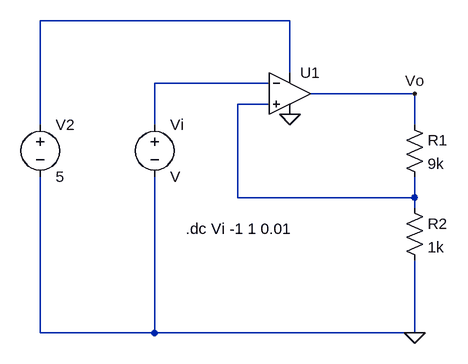
[diagram p0: schematic Experiment 12.asc]
Experiment 12.asc, the LTspice schematic file:
Version 4
SHEET 1 880 680
WIRE 256 32 -128 32
WIRE 256 112 256 32
WIRE 224 128 48 128
WIRE 448 144 288 144
WIRE 224 160 176 160
WIRE -128 192 -128 32
WIRE 48 192 48 128
WIRE 448 192 448 144
WIRE 176 304 176 160
WIRE 448 304 448 272
WIRE 448 304 176 304
WIRE 448 320 448 304
WIRE -128 512 -128 272
WIRE 48 512 48 272
WIRE 48 512 -128 512
WIRE 448 512 448 400
WIRE 448 512 48 512
FLAG 256 176 0
FLAG 448 512 0
FLAG 448 144 Vo
SYMBOL Opamps\\UniversalOpamp2 256 144 R0
SYMATTR InstName U1
SYMBOL voltage 48 176 R0
SYMATTR InstName Vi
SYMBOL res 432 176 R0
SYMATTR InstName R1
SYMATTR Value 9k
SYMBOL res 432 304 R0
SYMATTR InstName R2
SYMATTR Value 1k
SYMBOL voltage -128 176 R0
WINDOW 123 0 0 Left 0
WINDOW 39 0 0 Left 0
SYMATTR InstName V2
SYMATTR Value 5
TEXT 96 352 Left 2 !.dc Vi -1 1 0.01

The netlist it stands for:
* Experiment 12.asc
XU1 N003 N002 N001 0 Vo level.2 Avol=1Meg GBW=10Meg Slew=10Meg ilimit=25m rail=0 Vos=0 phimargin=45 en=0 enk=0 in=0 ink=0 Rin=500Meg  ; pins IN+ IN- V+ V- OUT
Vi N002 0 V
R1 Vo N003 9k
R2 N003 0 1k
V2 N001 0 5
.dc Vi -1 1 0.01
.lib UniversalOpamps2.sub
.backanno
.end